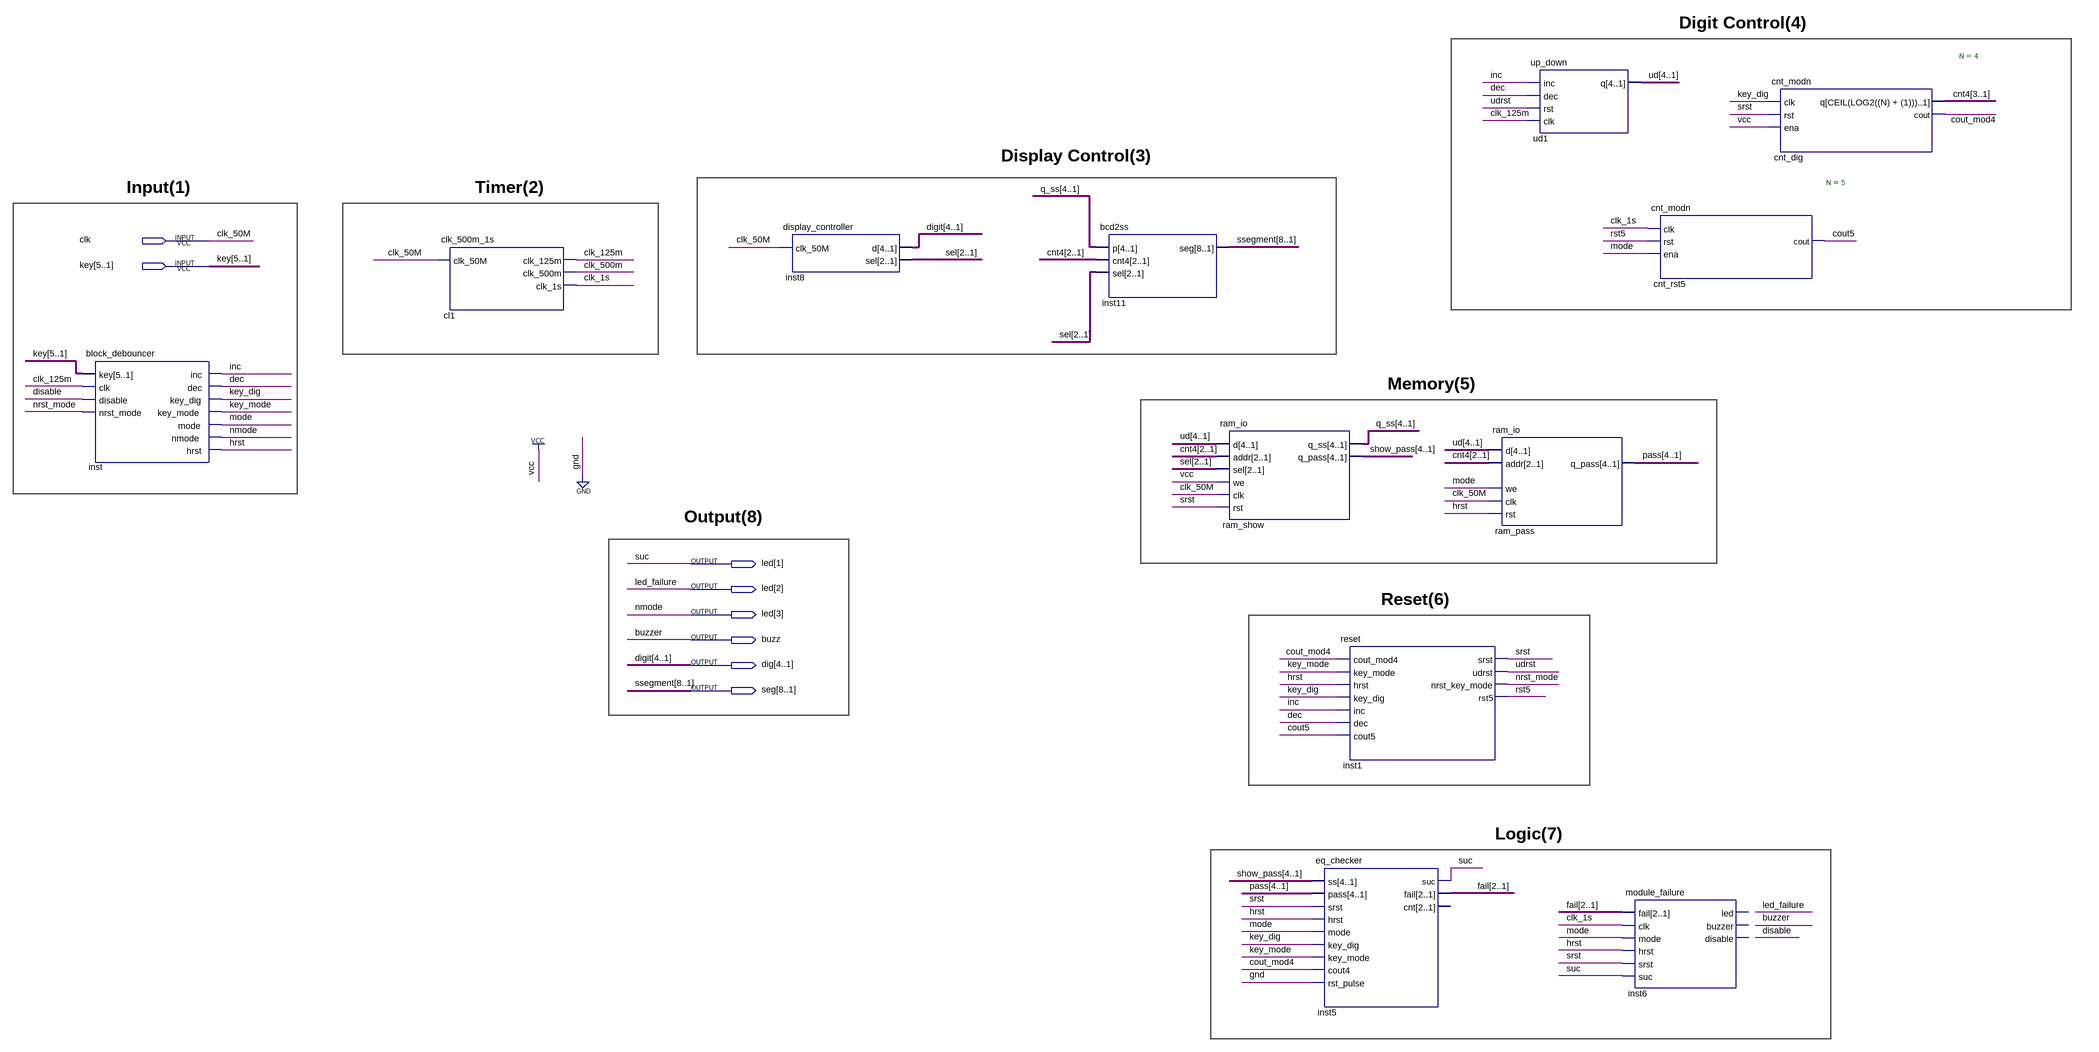
[diagram p0: schematic sheet]
// Quartus schematic cofre.bdf as structural Verilog: 12 symbols, 8 pins
module cofre (
  input  clk,
  input  [5:1] key,
  output [3:1] led,
  output buzz,
  output [4:1] dig,
  output [8:1] seg
);

  wire clk_1s, clk_125m, clk_500m, cout5, cout_mod4, dec, \disable , hrst, inc, key_dig, key_mode, mode,
       nrst_mode, rst5, srst, udrst;
  wire [2:1] fail, sel;
  wire [3:1] cnt4;
  wire [4:1] pass, q_ss, show_pass, ud;

  block_debouncer inst (
    .key(key), .clk(clk_125m), .\disable (\disable ), .nrst_mode(nrst_mode), .inc(inc), .dec(dec),
    .key_dig(key_dig), .key_mode(key_mode), .mode(mode), .nmode(led[3]), .hrst(hrst));
  clk_500m_1s cl1 (.clk_50M(clk), .clk_125m(clk_125m), .clk_500m(clk_500m), .clk_1s(clk_1s));
  display_controller inst8 (.clk_50M(clk), .d(dig), .sel(sel));
  bcd2ss inst11 (.p(q_ss), .cnt4(cnt4[2:1]), .sel(sel), .seg(seg));
  ram_io ram_show (
    .d(ud), .addr(cnt4[2:1]), .sel(sel), .we(1'b1), .clk(clk), .rst(srst), .q_ss(q_ss), .q_pass(show_pass));
  reset inst1 (
    .cout_mod4(cout_mod4), .key_mode(key_mode), .hrst(hrst), .key_dig(key_dig), .inc(inc), .dec(dec),
    .cout5(cout5), .srst(srst), .udrst(udrst), .nrst_key_mode(nrst_mode), .rst5(rst5));
  eq_checker inst5 (
    .ss(show_pass), .pass(pass), .srst(srst), .hrst(hrst), .mode(mode), .key_dig(key_dig),
    .key_mode(key_mode), .cout4(cout_mod4), .rst_pulse(1'b0), .suc(led[1]), .fail(fail));  // open: cnt
  ram_io ram_pass (.d(ud), .addr(cnt4[2:1]), .we(mode), .clk(clk), .rst(hrst), .q_pass(pass));
  up_down ud1 (.inc(inc), .dec(dec), .rst(udrst), .clk(clk_125m), .q(ud));
  module_failure inst6 (
    .fail(fail), .clk(clk_1s), .mode(mode), .hrst(hrst), .srst(srst), .suc(led[1]));  // open: led, buzzer, disable
  cnt_modn #(.N(5)) cnt_rst5 (.clk(clk_1s), .rst(rst5), .ena(mode), .cout(cout5));
  cnt_modn #(.N(4)) cnt_dig (.clk(key_dig), .rst(srst), .ena(1'b1), .q(cnt4), .cout(cout_mod4));

  // Other names for the same wires on the sheet: buzzer = buzz; clk_50M = clk; digit[4:1] = dig; led_failure = led[2];
  //   nmode = led[3]; ssegment[8:1] = seg; suc = led[1]

  // Notes on the sheet:
  //   Digit Control(4)
  //   Display Control(3)
  //   Input(1)
  //   Timer(2)
  //   Memory(5)
  //   Output(8)
  //   Reset(6)
  //   Logic(7)
endmodule
